# Altium schematic sheet PCIe_USB30_Power.SchDoc
size A4; SheetNumber: 10; SheetTotal: 11
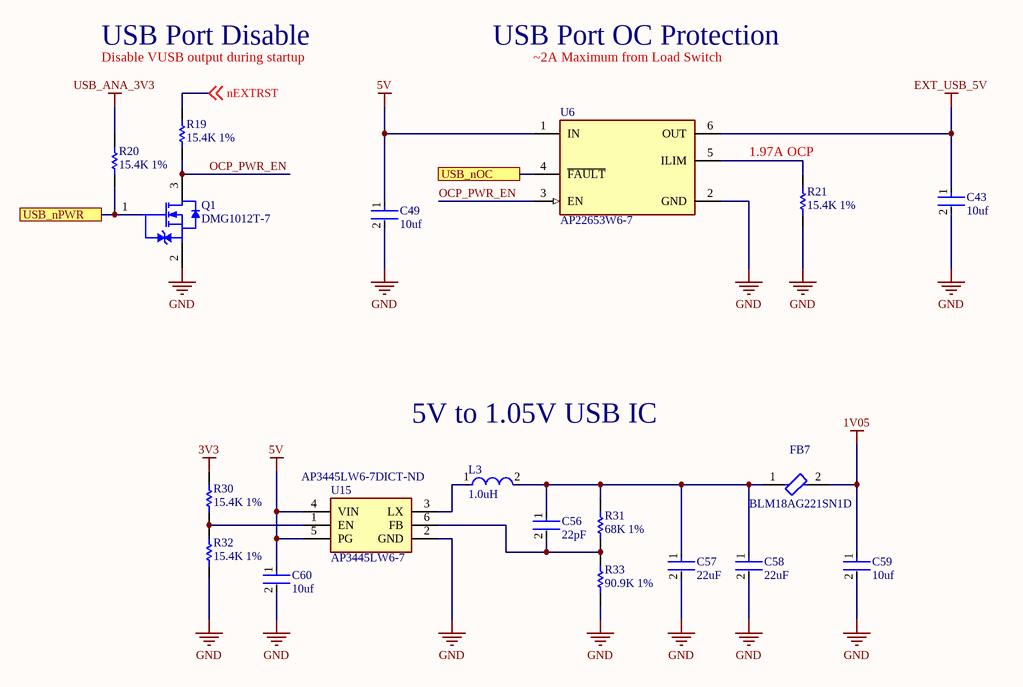
[diagram p0: PCIe_USB30_Power.SchDoc]

## Parts
C43  10uf  [FP-GRM188-0_2-IPC_C]
C49  10uf  [FP-GRM188-0_2-IPC_C]
C56  22pF  [FP-C0603C-CF-MFG]
C57  22uF  [FP-GRM21B-0_15-MFG]
C58  22uF  [FP-GRM21B-0_15-MFG]
C59  10uf  [FP-GRM188-0_2-IPC_C]
C60  10uf  [FP-GRM188-0_2-IPC_C]
FB7  BLM18AG221SN1D  [FP-BLM18-0_15-t0_8-IPC_A]
L3  1.0uH  [FP-NR4018-MFG]
Q1  DMG1012T-7  [DIOD-SOT523-3_V]
R19  15.4K 1%  [RESC1005X40X25ML05T10]
R20  15.4K 1%  [RESC1005X40X25ML05T10]
R21  15.4K 1%  [RESC1005X40X25ML05T10]
R30  15.4K 1%  [RESC1005X40X25ML05T10]
R31  68K 1%  [RESC1005X40X25ML05T05]
R32  15.4K 1%  [RESC1005X40X25ML05T10]
R33  90.9K 1%  [RESC1005X40X25NL05T10]
U6  AP22653W6-7  [FP-SOT26-MFG]
U15  AP3445LW6-7  Supplier Part Number 1: AP3445LW6-7DICT-ND  [SOT95P285X140-6N]

## Ports
USB_nOC, USB_nPWR

## Nets
1V05: C59.1 FB7.2
3V3: R30.2
5V: C49.1 C60.1 U6.1(IN) U15.4(VIN) U15.5(PG)
EXT_USB_5V: C43.1 U6.6(OUT)
GND: C43.2 C49.2 C57.2 C58.2 C59.2 C60.2 Q1.2(S) R21.1 R32.1 R33.1 U6.2(GND) U15.2(GND)
USB_ANA_3V3: R20.2
nEXTRST: R19.2 ; off-sheet nEXTRST
OCP_PWR_EN: Q1.3(D) R19.1 U6.3(EN)
USB_nOC: U6.4(~{FAULT}) ; port USB_nOC
USB_nPWR: Q1.1(G) R20.1 ; port USB_nPWR
NetC56_1: C56.1 C57.1 C58.1 FB7.1 L3.2 R31.1
NetC56_2: C56.2 R31.2 R33.2 U15.6(FB)
NetL3_1: L3.1 U15.3(LX)
NetR21_2: R21.2 U6.5(ILIM)
NetR30_1: R30.1 R32.2 U15.1(EN)

## Notes on the sheet
- USB Port Disable
- Disable VUSB output during startup
- USB Port OC Protection
- ~2A Maximum from Load Switch
- (near R21) 1.97A OCP
- 5V to 1.05V USB IC

## Library data of the parts
C43 C49 C59 C60 = CMP-06035-045466-1: Chip Multilayer Ceramic Capacitors for General Purpose, 0603, 10uF, X5R, 15%, 20%, 35V; Case Code (Imperial): 0603; Voltage Rating (DC): 35V; Width: 0.031inch; Dielectric: X5R; Voltage Rating: 35V; Min Operating Temperature: -55°C; Thickness: 0.039inch; Mount: Surface Mount; Case/Package: 0603; Length: 0.063inch; Capacitance: 10uF; Max Operating Temperature: 85°C; Packaging: Tape and Reel; Tolerance: 20%; Case Code (Metric): 1608
C56 = CMP-1035-00818-3: CAP CER 22PF 50V NP0 0603; Manufacturer Part Number: C0603C220D5GACTU; Manufacturer: KEMET; Temperature Coefficient: 30ppm/°C; Tolerance: 0.5 pF; Automotive Grade: Grade 1; Material: Ceramic; Temperature Characteristic: C0G; Category: Cap; Octopart: https://octopart.com/c0603c220d5gactu-kemet-9143734; Package: C0603C-CF; ComponentLink2Description: Datasheet; Temperature: -55°C to +125°C; RoHS: TRUE; Digikey Description: CAP CER 22PF 50V NP0 0603; Lead Free: Yes; ComponentLink2URL: https://api.kemet.com/component-edge/download/datasheet/C0603C100J5GACAUTO.pdf; Mouser Description: Multilayer Ceramic Capacitors MLCC - SMD/SMT 50volts 22pF C0G 0.5%; Temperature Range Low: -55°C; Temperature Range High: +125°C; Device Class L1: Passive Components; Device Class L2: Capacitors; Device Class L3: Ceramic Capacitors; Voltage Rating: 50 V; Automotive: Yes; Capacitance: 22 pF; Height: 0.87mm; Value: 22 pF
C57 C58 = CMP-2007-03385-2: Chip Multilayer Ceramic Capacitors for General Purpose, 0805, 22uF, X5R, 15%, 20%, 6.3V; Material: Ceramic; Max Operating Temperature: 85°C; Voltage: 6.3V; Min Operating Temperature: -55°C; Case/Package: 0805; Thickness: 0.053inch; Dielectric: X5R; Packaging: Tape and Reel; Depth: 1.25mm; Termination: SMD/SMT; Voltage Rating (DC): 6.3V; Radiation Hardening: No; Tolerance: 20%; Mount: Surface Mount; Lead Free: Lead Free; Package Quantity: 1; REACH SVHC: No SVHC; Voltage Rating: 6.3V; Capacitance: 22uF; Length: 2mm; Case Code (Imperial): 0805; Case Code (Metric): 2012; Width: 0.049inch; Height: 1.25mm
FB7 = CMP-0686-00445-3: Chip Ferrite Bead, 0603, 220Ω @ 100MHz, 0.25Ω, 25%, 700mA; DC Current: 500mA; DC Resistance-Max: 250mR; Shielding: Unshielded; Material: Steel; Impedance: 220R; Number of Lines: 1; Max Operating Temperature: 125°C; Military Standard: Not; Min Operating Temperature: -55°C; Max DC Current: 500mA; Case/Package: 0603; Termination: SMD/SMT; Current Rating: 500mA; REACH SVHC: No SVHC; Depth: 0.8mm; Number of Pins: 2; Radiation Hardening: No; Length: 1.6mm; Packaging: Tape and Reel; Test Frequency: 100MHz; Series: BLM18A; Package Quantity: 1; Tolerance: 25%; Case Code (Imperial): 0603; DC Resistance (DCR): 250mR; Height: 0.8mm; Lead Free: Lead Free; Width: 0.8mm; Case Code (Metric): 1608; RoHS Compliant: Yes; Frequency: 100MHz; Core Material: Ferrite; Number of Circuits: 1; Max Current Rating: 500mA
L3 = CMP-14484-000491-1: SMD Power Inductors for Automotive Applications 1.0uH ±30% 3.2A 32.4mΩ; Shielding: Shielded; Saturation Current: 4A; Core Material: Ferrite; Test Frequency: 100kHz; Inductance: 1uH; Self Resonant Frequency: 90MHz; DC Resistance (DCR): 32.4mR; Package Quantity: 3500; Resistor Type: Wirewound; Halogen Free: Halogen Free; Width: 0.157inch; Termination: SMD/SMT; Packaging: Tape and Reel; Max DC Current: 3.2A; Case/Package: Nonstandard; Current Rating: 3.2A; RoHS Compliant: Yes; Height: 1.8mm; Tolerance: 30%; Length: 4mm; Weight: 0.003527oz; Ratings: AEC-Q200; Mount: Surface Mount; Max Operating Temperature: 125°C; Height - Seated (Max): 0.071inch; Min Operating Temperature: -40°C
Q1 = CMP-2000-07450-1: N-Channel Enhancement Mode MOSFET, 20 V, 630 mA, -55 to 150 degC, 3-Pin SOT23, RoHS, Tape and Reel; Manufacturer: Diodes Inc; Continuous Drain Current (ID): 630mA; Number of Channels: 1; Drain to Source Voltage (Vdss): 20V; Gate to Source Voltage (Vgs): 6V; Turn-On Delay Time: 5.1ns; Rds On Max: 400mOhm; Power Dissipation: 280mW; Fall Time: 12.3ns; Input Capacitance: 60.67pF; Turn-Off Delay Time: 26.7ns; Rise Time: 7.4ns; Drain to Source Resistance: 300mOhm; Element Configuration: Single; Case\/Package: SOT-523; Threshold Voltage: 1V; Manufacturer URL: http://www.diodes.com/; Datasheet URL: https://www.diodes.com/assets/Datasheets/ds31783.pdf; Mount: SurfaceMount; Width: 0.85mm; REACH SVHC: NoSVHC; Datasheet Version: Rev. 3-2, 01/2012; Lead Free: LeadFree; Number of Pins: 3; Drain to Source Breakdown Voltage: 20V; Height: 0.8mm; Length: 1.7mm; Radiation Hardening: No; Packaging: TapeandReel; Contact Plating: Matte; Max Operating Temperature: 150degC; RoHSCompliant: true; Weight: 7.1E-05oz; Package Reference: SOT523-3; Package Quantity: 3000; Max Power Dissipation: 280mW; Package Description: 3-Pin Small Outline Transistor, Body 1.6 x 0.8 mm, Pitch 0.5 mm; On-State Resistance: 400MOhm; Min Operating Temperature: -55degC; Number of Elements: 1; Mounting Technology: SurfaceMount
R19-R21 R30 R32 = CMP-1011-00642-2: Part Number: RC0402FR-0715K4L; Manufacturer: Yageo
R31 = CMP-2002-01168-1: Part Number: ERJ2RKF6802X; Manufacturer: Panasonic
R33 = CMP-2002-07837-1: Manufacturer: Yageo; Part Number: RC0402FR-0790K9L
U6 = CMP-12749-000002-1: LOAD SWITCH,SOT26,T&R,3K
U15 = AP3445LW6-7: Integrated Circuit; Manufacturer_Name: Diodes Inc.; Datasheet Link: https://www.mouser.com/datasheet/2/115/AP3445-L-1382378.pdf; Height: 1.4mm; Manufacturer_Part_Number: AP3445LW6-7; Mouser Part Number: 621-AP3445LW6-7; Mouser Price/Stock: https://www.mouser.co.uk/ProductDetail/Diodes-Incorporated/AP3445LW6-7?qs=%252BEew9%252B0nqrAxy08hG7uGeQ%3D%3D; Arrow Part Number: AP3445LW6-7; Arrow Price/Stock: https://www.arrow.com/en/products/ap3445lw6-7/diodes-incorporated; Supplier 1: Digi-Key